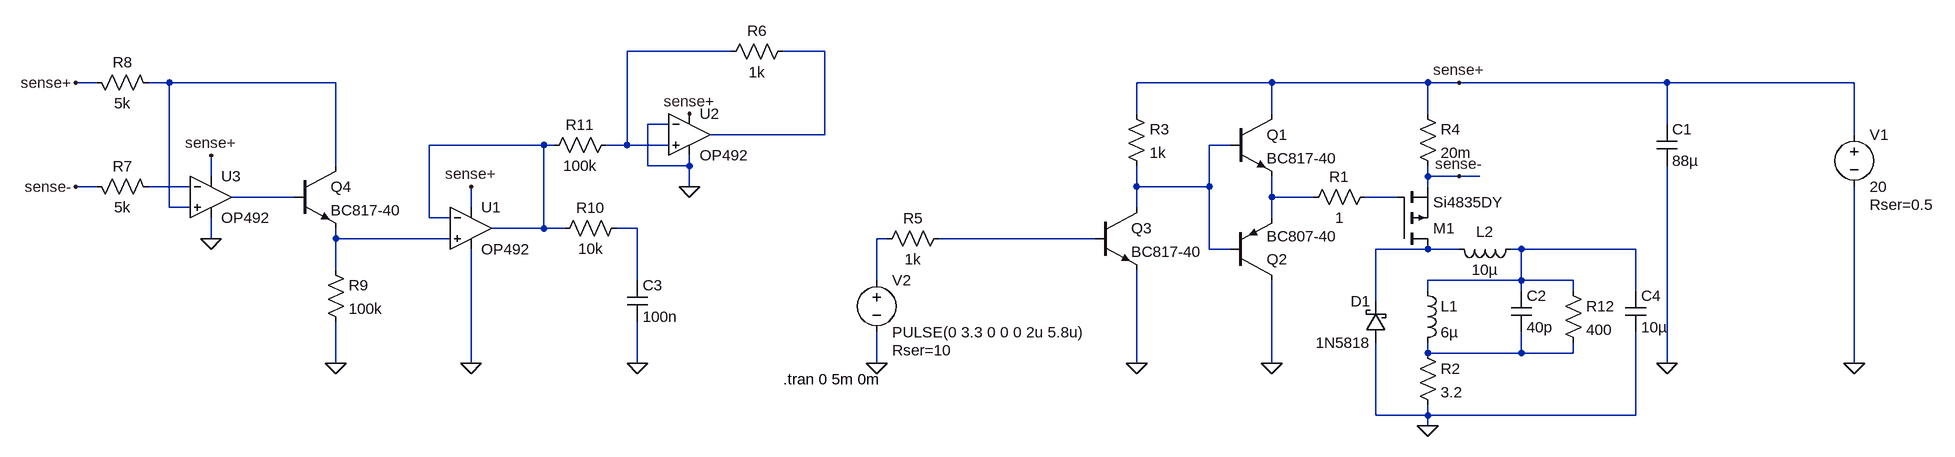
[diagram p0: schematic switchmode.asc]
switchmode.asc, the LTspice schematic file:
Version 4
SHEET 1 2088 680
WIRE -336 64 -496 64
WIRE -192 64 -256 64
WIRE -1312 112 -1344 112
WIRE -1200 112 -1232 112
WIRE -944 112 -1200 112
WIRE 496 112 288 112
WIRE 736 112 496 112
WIRE 784 112 736 112
WIRE 1104 112 784 112
WIRE 1392 112 1104 112
WIRE 288 160 288 112
WIRE 496 160 496 112
WIRE 736 160 736 112
WIRE -432 176 -464 176
WIRE 1104 176 1104 112
WIRE -192 192 -192 64
WIRE -192 192 -368 192
WIRE 1392 192 1392 112
WIRE -624 208 -800 208
WIRE -608 208 -624 208
WIRE -496 208 -496 64
WIRE -496 208 -528 208
WIRE -432 208 -496 208
WIRE 432 208 400 208
WIRE -944 240 -944 112
WIRE -464 240 -464 176
WIRE -400 240 -400 224
WIRE -400 240 -464 240
WIRE -1136 256 -1136 224
WIRE 736 256 736 240
WIRE 784 256 736 256
WIRE 816 256 784 256
WIRE -1312 272 -1344 272
WIRE -1168 272 -1232 272
WIRE -400 272 -400 240
WIRE 288 272 288 240
WIRE 400 272 400 208
WIRE 400 272 288 272
WIRE 736 272 736 256
WIRE -1008 288 -1104 288
WIRE 496 288 496 256
WIRE 560 288 496 288
WIRE 688 288 640 288
WIRE -1200 304 -1200 112
WIRE -1168 304 -1200 304
WIRE -736 304 -736 272
WIRE 288 304 288 272
WIRE -800 320 -800 208
WIRE -768 320 -800 320
WIRE 496 320 496 288
WIRE -624 336 -624 208
WIRE -624 336 -704 336
WIRE -592 336 -624 336
WIRE -480 336 -512 336
WIRE -1136 352 -1136 320
WIRE -944 352 -944 336
WIRE -768 352 -944 352
WIRE -96 352 -112 352
WIRE 224 352 -16 352
WIRE 400 368 400 272
WIRE 432 368 400 368
WIRE 736 368 656 368
WIRE 784 368 736 368
WIRE 880 368 864 368
WIRE 1056 368 880 368
WIRE -944 400 -944 352
WIRE -480 416 -480 336
WIRE -112 416 -112 352
WIRE 880 416 880 368
WIRE 880 416 736 416
WIRE 960 416 880 416
WIRE 736 432 736 416
WIRE 880 432 880 416
WIRE 960 432 960 416
WIRE 1056 432 1056 368
WIRE 656 448 656 368
WIRE 736 528 736 512
WIRE 880 528 880 496
WIRE 880 528 736 528
WIRE 960 528 960 512
WIRE 960 528 880 528
WIRE -944 544 -944 480
WIRE -736 544 -736 368
WIRE -480 544 -480 480
WIRE -112 544 -112 496
WIRE 288 544 288 400
WIRE 496 544 496 416
WIRE 1104 544 1104 240
WIRE 1392 544 1392 272
WIRE 656 624 656 512
WIRE 736 624 736 608
WIRE 736 624 656 624
WIRE 1056 624 1056 496
WIRE 1056 624 736 624
WIRE 736 640 736 624
FLAG 736 640 0
FLAG 496 544 0
FLAG 1104 544 0
FLAG 288 544 0
FLAG -112 544 0
FLAG 784 112 sense+
FLAG 784 256 sense-
FLAG -1344 272 sense-
FLAG -1344 112 sense+
FLAG -944 544 0
FLAG -1136 352 0
FLAG -1136 224 sense+
FLAG -736 544 0
FLAG -736 272 sense+
FLAG -480 544 0
FLAG -400 272 0
FLAG -400 160 sense+
FLAG 1392 544 0
SYMBOL npn 432 160 R0
SYMATTR InstName Q1
SYMATTR Value BC817-40
SYMBOL pnp 432 416 M180
SYMATTR InstName Q2
SYMATTR Value BC807-40
SYMBOL res 656 272 R90
WINDOW 0 0 56 VBottom 2
WINDOW 3 32 56 VTop 2
SYMATTR InstName R1
SYMATTR Value 1
SYMBOL pmos 688 368 M180
SYMATTR InstName M1
SYMATTR Value Si4835DY
SYMBOL res 720 512 R0
SYMATTR InstName R2
SYMATTR Value 3.2
SYMBOL cap 1088 176 R0
SYMATTR InstName C1
SYMATTR Value 88µ
SYMATTR SpiceLine Rser=0.03
SYMBOL voltage -112 400 R0
WINDOW 123 0 0 Left 0
WINDOW 39 24 124 Left 2
SYMATTR SpiceLine Rser=10
SYMATTR InstName V2
SYMATTR Value PULSE(0 3.3 0 0 0 2u 5.8u)
SYMBOL npn 224 304 R0
SYMATTR InstName Q3
SYMATTR Value BC817-40
SYMBOL res 272 144 R0
SYMATTR InstName R3
SYMATTR Value 1k
SYMBOL res 0 336 R90
WINDOW 0 0 56 VBottom 2
WINDOW 3 32 56 VTop 2
SYMATTR InstName R5
SYMATTR Value 1k
SYMBOL res 720 144 R0
SYMATTR InstName R4
SYMATTR Value 20m
SYMBOL npn -1008 240 R0
SYMATTR InstName Q4
SYMATTR Value BC817-40
SYMBOL res -1328 256 M90
WINDOW 0 0 56 VBottom 2
WINDOW 3 32 56 VTop 2
SYMATTR InstName R7
SYMATTR Value 5k
SYMBOL res -1328 96 M90
WINDOW 0 0 56 VBottom 2
WINDOW 3 32 56 VTop 2
SYMATTR InstName R8
SYMATTR Value 5k
SYMBOL res -960 384 R0
SYMATTR InstName R9
SYMATTR Value 100k
SYMBOL res -496 320 R90
WINDOW 0 0 56 VBottom 2
WINDOW 3 32 56 VTop 2
SYMATTR InstName R10
SYMATTR Value 10k
SYMBOL cap -496 416 R0
SYMATTR InstName C3
SYMATTR Value 100n
SYMBOL Opamps\\OP492 -1136 224 R0
SYMATTR InstName U3
SYMBOL Opamps\\OP492 -736 272 R0
SYMATTR InstName U1
SYMBOL Opamps\\OP492 -400 128 R0
SYMATTR InstName U2
SYMBOL res -240 48 R90
WINDOW 0 0 56 VBottom 2
WINDOW 3 32 56 VTop 2
SYMATTR InstName R6
SYMATTR Value 1k
SYMBOL res -512 192 R90
WINDOW 0 0 56 VBottom 2
WINDOW 3 32 56 VTop 2
SYMATTR InstName R11
SYMATTR Value 100k
SYMBOL ind 720 416 R0
SYMATTR InstName L1
SYMATTR Value 6µ
SYMBOL cap 864 432 R0
SYMATTR InstName C2
SYMATTR Value 40p
SYMATTR SpiceLine Rser=0
SYMBOL schottky 672 512 R180
WINDOW 0 24 64 Left 2
WINDOW 3 24 0 Left 2
SYMATTR InstName D1
SYMATTR Value 1N5818
SYMATTR Description Diode
SYMATTR Type diode
SYMBOL res 944 416 R0
SYMATTR InstName R12
SYMATTR Value 400
SYMBOL voltage 1392 176 R0
WINDOW 123 0 0 Left 0
WINDOW 39 24 124 Left 2
SYMATTR SpiceLine Rser=0.5
SYMATTR InstName V1
SYMATTR Value 20
SYMBOL ind 880 352 R90
WINDOW 0 5 56 VBottom 2
WINDOW 3 32 56 VTop 2
SYMATTR InstName L2
SYMATTR Value 10µ
SYMBOL cap 1040 432 R0
SYMATTR InstName C4
SYMATTR Value 10µ
TEXT -256 568 Left 2 !.tran 0 5m 0m

The netlist it stands for:
* switchmode.asc
Q1 sense+ N005 N008 0 BC817-40
Q2 0 N005 N008 0 BC807-40
R1 N009 N008 1
M1 N014 N009 sense- sense- Si4835DY
R2 N016 0 3.2
C1 sense+ 0 88µ Rser=0.03
V2 N012 0 PULSE(0 3.3 0 0 0 2u 5.8u) Rser=10
Q3 N005 N013 0 0 BC817-40
R3 sense+ N005 1k
R5 N013 N012 1k
R4 sense+ sense- 20m
Q4 N003 N007 N011 0 BC817-40
R7 sense- N006 5k
R8 sense+ N003 5k
R9 N011 0 100k
R10 N010 N004 10k
C3 N010 0 100n
XU3 N003 N006 sense+ 0 N007 OP492  ; pins In+ In- V+ V- OUT
XU1 N011 N004 sense+ 0 N004 OP492  ; pins In+ In- V+ V- OUT
XU2 N001 0 sense+ 0 N002 OP492  ; pins In+ In- V+ V- OUT
R6 N002 N001 1k
R11 N001 N004 100k
L1 N015 N016 6µ
C2 N015 N016 40p Rser=0
D1 0 N014 1N5818
R12 N015 N016 400
V1 sense+ 0 20 Rser=0.5
L2 N015 N014 10µ
C4 N015 0 10µ
.model D D
.lib standard.dio
.model NPN NPN
.model PNP PNP
.lib standard.bjt
.model NMOS NMOS
.model PMOS PMOS
.lib standard.mos
.tran 0 5m 0m
.backanno
.end